# EAGLE design Sche Gas (EAGLE 9.6.2)
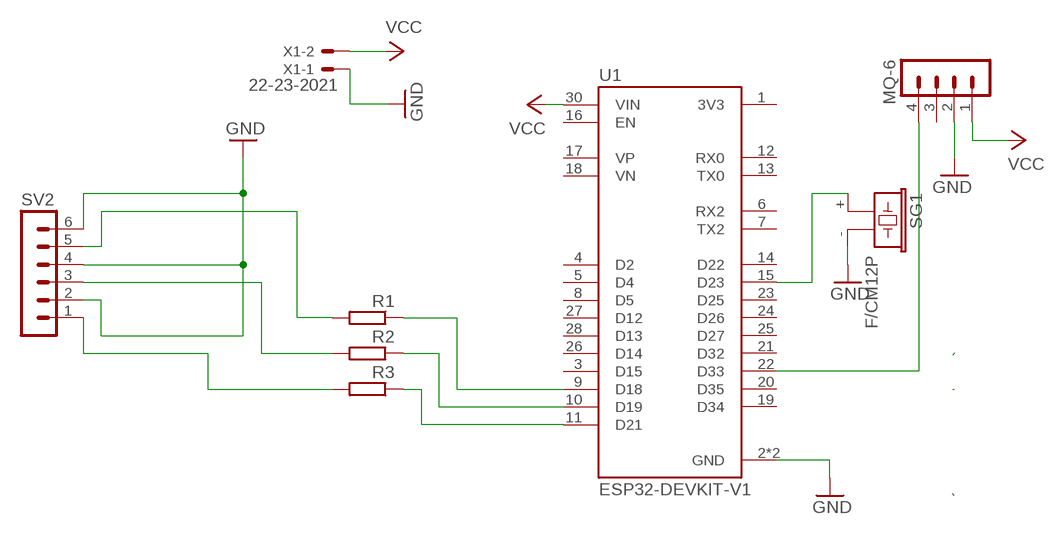
[diagram p0: schematic, sheet 1]

## Parts
MQ-6  MA04-1  [MA04-1]
R1  R-EU_0204/7  [0204/7]
R2  R-EU_0204/7  [0204/7]
R3  R-EU_0204/7  [0204/7]
SG1  F/CM12P  [F/CM12P]
SV2  MA06-1  [MA06-1]
U1  ESP32-DEVKIT-V1  [MODULE_ESP32_DEVKIT_V1]
X1  22-23-2021  [22-23-2021]

## Nets
GND: MQ-6.2 SG1.- SV2.2 SV2.4 SV2.6 U1.2(GND) U1.29(GND) X1.1
N$1: SG1.+ U1.15(D23)
N$3: R1.1 U1.9(D18)
N$4: MQ-6.4 U1.22(D33)
N$5: R3.1 U1.11(D21)
N$9: R1.2 SV2.5
N$10: R2.2 SV2.3
N$11: R3.2 SV2.1
N$12: R2.1 U1.10(D19)
VCC: MQ-6.1 U1.30(VIN) X1.2
Unconnected: MQ-6.3 U1.1(3V3) U1.3(D15) U1.4(D2) U1.5(D4) U1.6(RX2) U1.7(TX2) U1.8(D5) U1.12(RX0) U1.13(TX0) U1.14(D22) U1.16(EN) U1.17(VP) U1.18(VN) U1.19(D34) U1.20(D35) U1.21(D32) U1.23(D25) U1.24(D26) U1.25(D27) U1.26(D14) U1.27(D12) U1.28(D13)

## Library data of the parts
MQ-6 = con-lstb:MA04-1: PIN HEADER; OC_FARNELL: unknown; OC_NEWARK: unknown
R1-R3 = rcl:R-EU_: RESISTOR, European symbol; SPICEPREFIX: R
SG1 = buzzer:F/CM12P: BUZZER Source: Buerklin; OC_FARNELL: unknown; OC_NEWARK: unknown
SV2 = con-lstb:MA06-1: PIN HEADER; OC_FARNELL: unknown; OC_NEWARK: unknown
U1 = ESP32-DEVKIT-V1:ESP32-DEVKIT-V1: Dual core, Wi-Fi: 2.4 GHz up to 150 Mbits/s,BLE (Bluetooth Low Energy) and legacy Bluetooth, 32 bits, Up to 240 MHz Check availability <https://pricing.snapeda.com/parts/ESP32-DEVKIT-V1/Do%20it/view-part?ref=eda>; AVAILABILITY: Not in stock; CHECK_PRICES: https://www.snapeda.com/parts/ESP32-DEVKIT-V1/Do+it/view-part/?ref=eda; DESCRIPTION: Dual core, Wi-Fi: 2.4 GHz up to 150 Mbits/s,BLE (Bluetooth Low Energy) and legacy Bluetooth, 32 bits, Up to 240 MHz; MF: Do it; MP: ESP32-DEVKIT-V1; PACKAGE: None; PRICE: None; SNAPEDA_LINK: https://www.snapeda.com/parts/ESP32-DEVKIT-V1/Do+it/view-part/?ref=snap
X1 = con-molex:22-23-2021: .100" (2.54mm) Center Header - 2 Pin; MF: MOLEX; MPN: 22-23-2021; OC_FARNELL: 1462926; OC_NEWARK: 25C3832

## Board
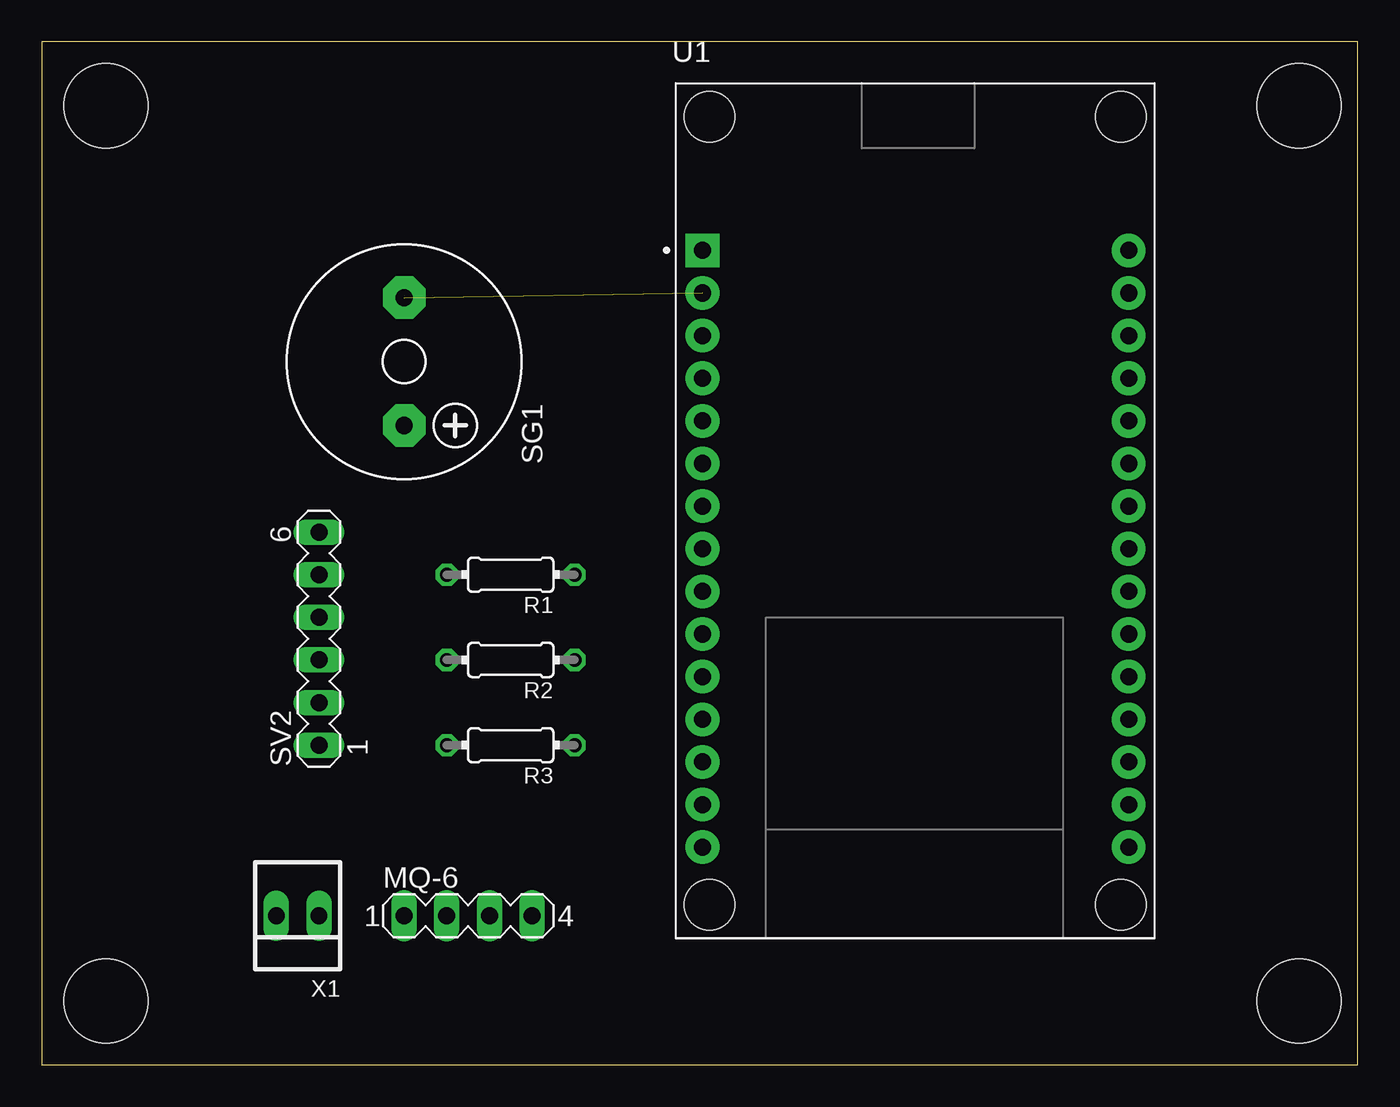
[diagram p1: board, top side]
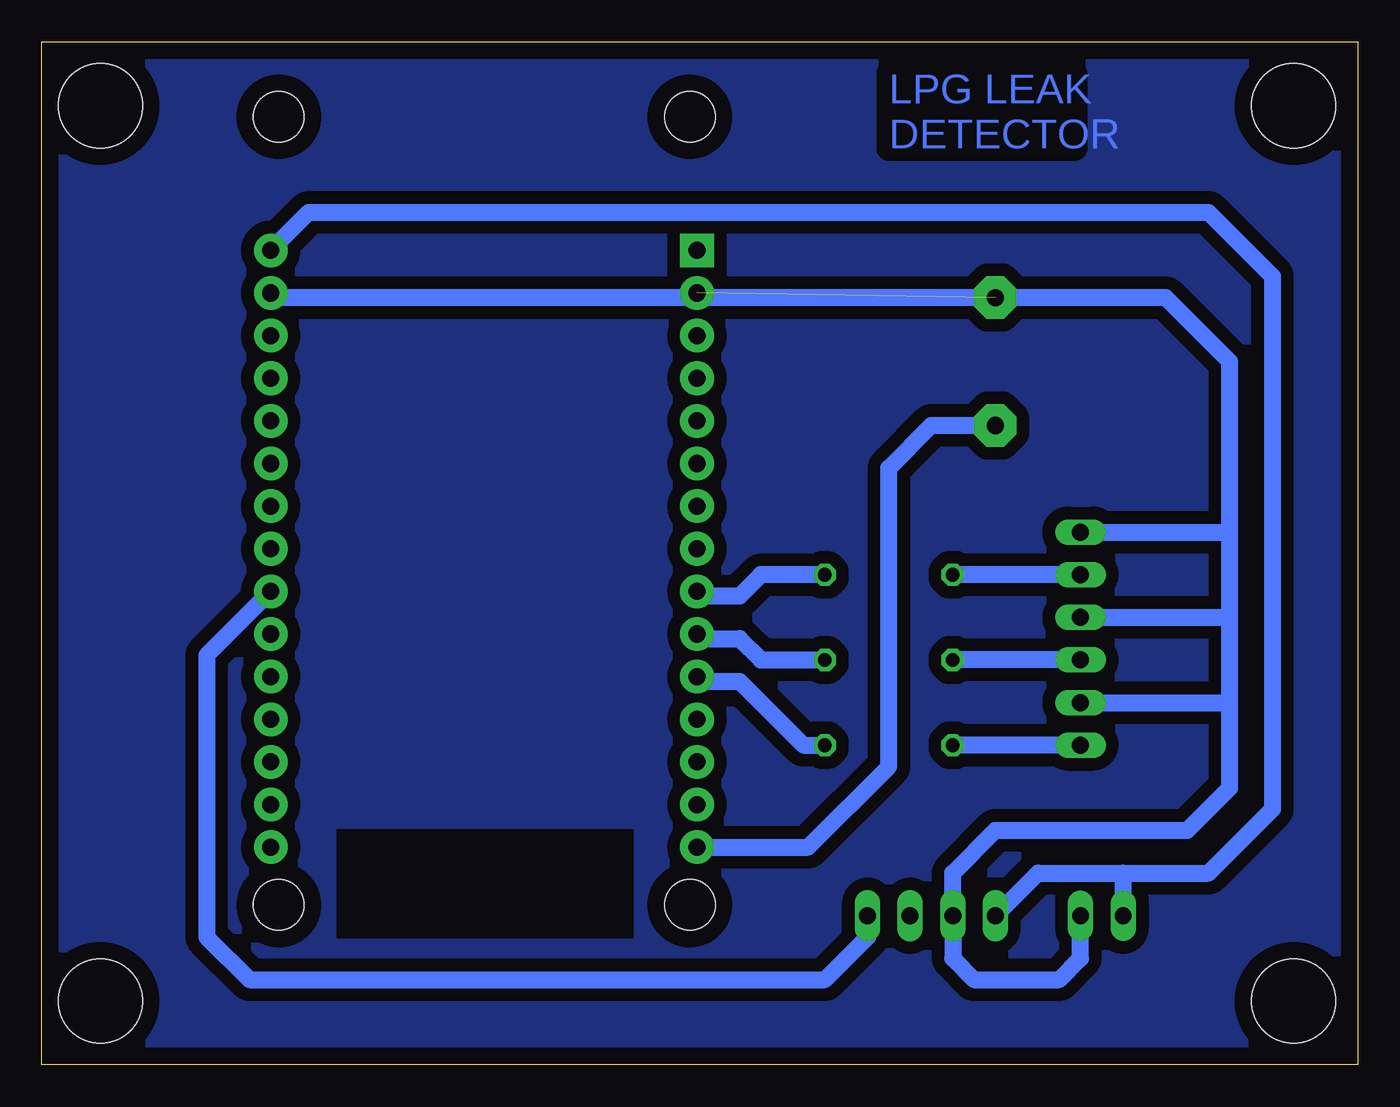
[diagram p2: board, bottom side, seen from below]

Size 78.41 x 60.95 mm. Coordinates in mm from the lower left corner, seen from the top.
Outline: 0,0 78.41,0 78.41,60.95 0,60.95 0,0
Copper layers (1*16): Top 0.035mm / dielectric 1.5mm / Bottom 0.035mm
Design rules "default *": minimum track width 6mil, minimum drill 0.35mm, track to track 30mil, track to pad 30mil, pad to pad 30mil, via to via 30mil, smd to smd 30mil, copper to edge 40mil, drill to drill 6mil, minimum pad ring 10mil, minimum via ring 8mil, stop-mask expansion 4mil, vias tented up to drill 0mil, thermal gap 10mil
Holes 5 mm at 3.81,57.15 74.93,57.15 74.93,3.81 3.81,3.81

### Footprints (pad centres in the part's own frame; a part is rotated, then mirrored left to right if it is on the bottom)
MA04-1 = drill 1.016 long: 1 -3.81,0; 2 -1.27,0; 3 1.27,0; 4 3.81,0
0204/7 = drill 0.813 octagon: 1 -3.81,0; 2 3.81,0
F/CM12P = drill 1.016 pad 2.54 octagon: + 3.81,0; - -3.81,0
MA06-1 = drill 1.016 long: 1 -6.35,0; 2 -3.81,0; 3 -1.27,0; 4 1.27,0; 5 3.81,0; 6 6.35,0
MODULE_ESP32_DEVKIT_V1 = drill 1.02 pad 2 square: 1 -12.7,15.515 | drill 1.02 pad 2: 2 -12.7,12.975; 3 -12.7,10.435; 4 -12.7,7.895; 5 -12.7,5.355; 6 -12.7,2.815; 7 -12.7,0.275; 8 -12.7,-2.265; 9 -12.7,-4.805; 10 -12.7,-7.345; 11 -12.7,-9.885; 12 -12.7,-12.425; 13 -12.7,-14.965; 14 -12.7,-17.505; 15 -12.7,-20.045; 16 12.7,-20.045; 17 12.7,-17.505; 18 12.7,-14.965; 19 12.7,-12.425; 20 12.7,-9.885; 21 12.7,-7.345; 22 12.7,-4.805; 23 12.7,-2.265; 24 12.7,0.275; 25 12.7,2.815; 26 12.7,5.355; 27 12.7,7.895; 28 12.7,10.435; 29 12.7,12.975; 30 12.7,15.515 | hole 3: -12.28,-23.475; 12.23,-23.475; 12.23,23.475; -12.28,23.475
22-23-2021 = drill 1 long: 1 -1.27,0; 2 1.27,0

### Placement (x,y rotation side)
MQ-6  25.4,8.89 0 top
R1  27.94,29.21 180 top
R2  27.94,24.13 180 top
R3  27.94,19.05 180 top
SG1  21.59,41.91 270 top
SV2  16.51,25.4 90 top
U1  52.07,33.02 0 top
X1  15.24,8.89 180 top

### Tracks (layer width: path | path; a pad name or v marks a point on that pad's centre or on a via)
AGND
  pour Bottom: 0,60.96 78.74,60.96 78.74,0 0,0
GND  (1 unrouted)
  Bottom 1.016: U1.29 64.5,45.72 SG1.- 11.43,45.72 7.62,41.91 7.62,31.75 | 7.62,21.59 7.62,16.51 10.16,13.97 21.59,13.97 24.13,11.43 MQ-6.2 24.13,6.35 22.86,5.08 17.78,5.08 16.51,6.35 X1.1 | 7.62,21.59 7.62,26.67 | 7.62,26.67 7.62,31.75 | SV2.6 7.62,31.75 | SV2.4 7.62,26.67 | SV2.2 7.62,21.59
N$1
  Bottom 1.016: U1.15 32.74,12.97 27.94,17.78 27.94,35.56 25.4,38.1 SG1.+
N$3
  Bottom 1.016: R1.1 35.56,29.21 36.83,27.94 39.09,27.94 U1.9
N$4
  Bottom 1.016: U1.22 68.58,24.4 68.58,7.62 66.04,5.08 31.75,5.08 29.21,7.62 MQ-6.4
N$5
  Bottom 1.016: U1.11 39.09,22.86 36.83,22.86 33.02,19.05 R3.1
N$9
  Bottom 1.016: SV2.5 R1.2
N$10
  Bottom 1.016: SV2.3 R2.2
N$11
  Bottom 1.016: SV2.1 R3.2
N$12
  Bottom 1.016: U1.10 39.09,25.4 36.83,25.4 35.56,24.13 R2.1
VCC
  Bottom 1.016: U1.30 62.51,50.8 8.89,50.8 5.08,46.99 5.08,15.24 8.89,11.43 13.97,11.43 | MQ-6.1 19.05,11.43 13.97,11.43 | X1.2 13.97,11.43

### Text on the board
Bottom: LPG LEAK / DETECTOR